# Altium schematic sheet LAN8870_PINOUT.SchDoc
size C; SheetNumber: 19; SheetTotal: 20
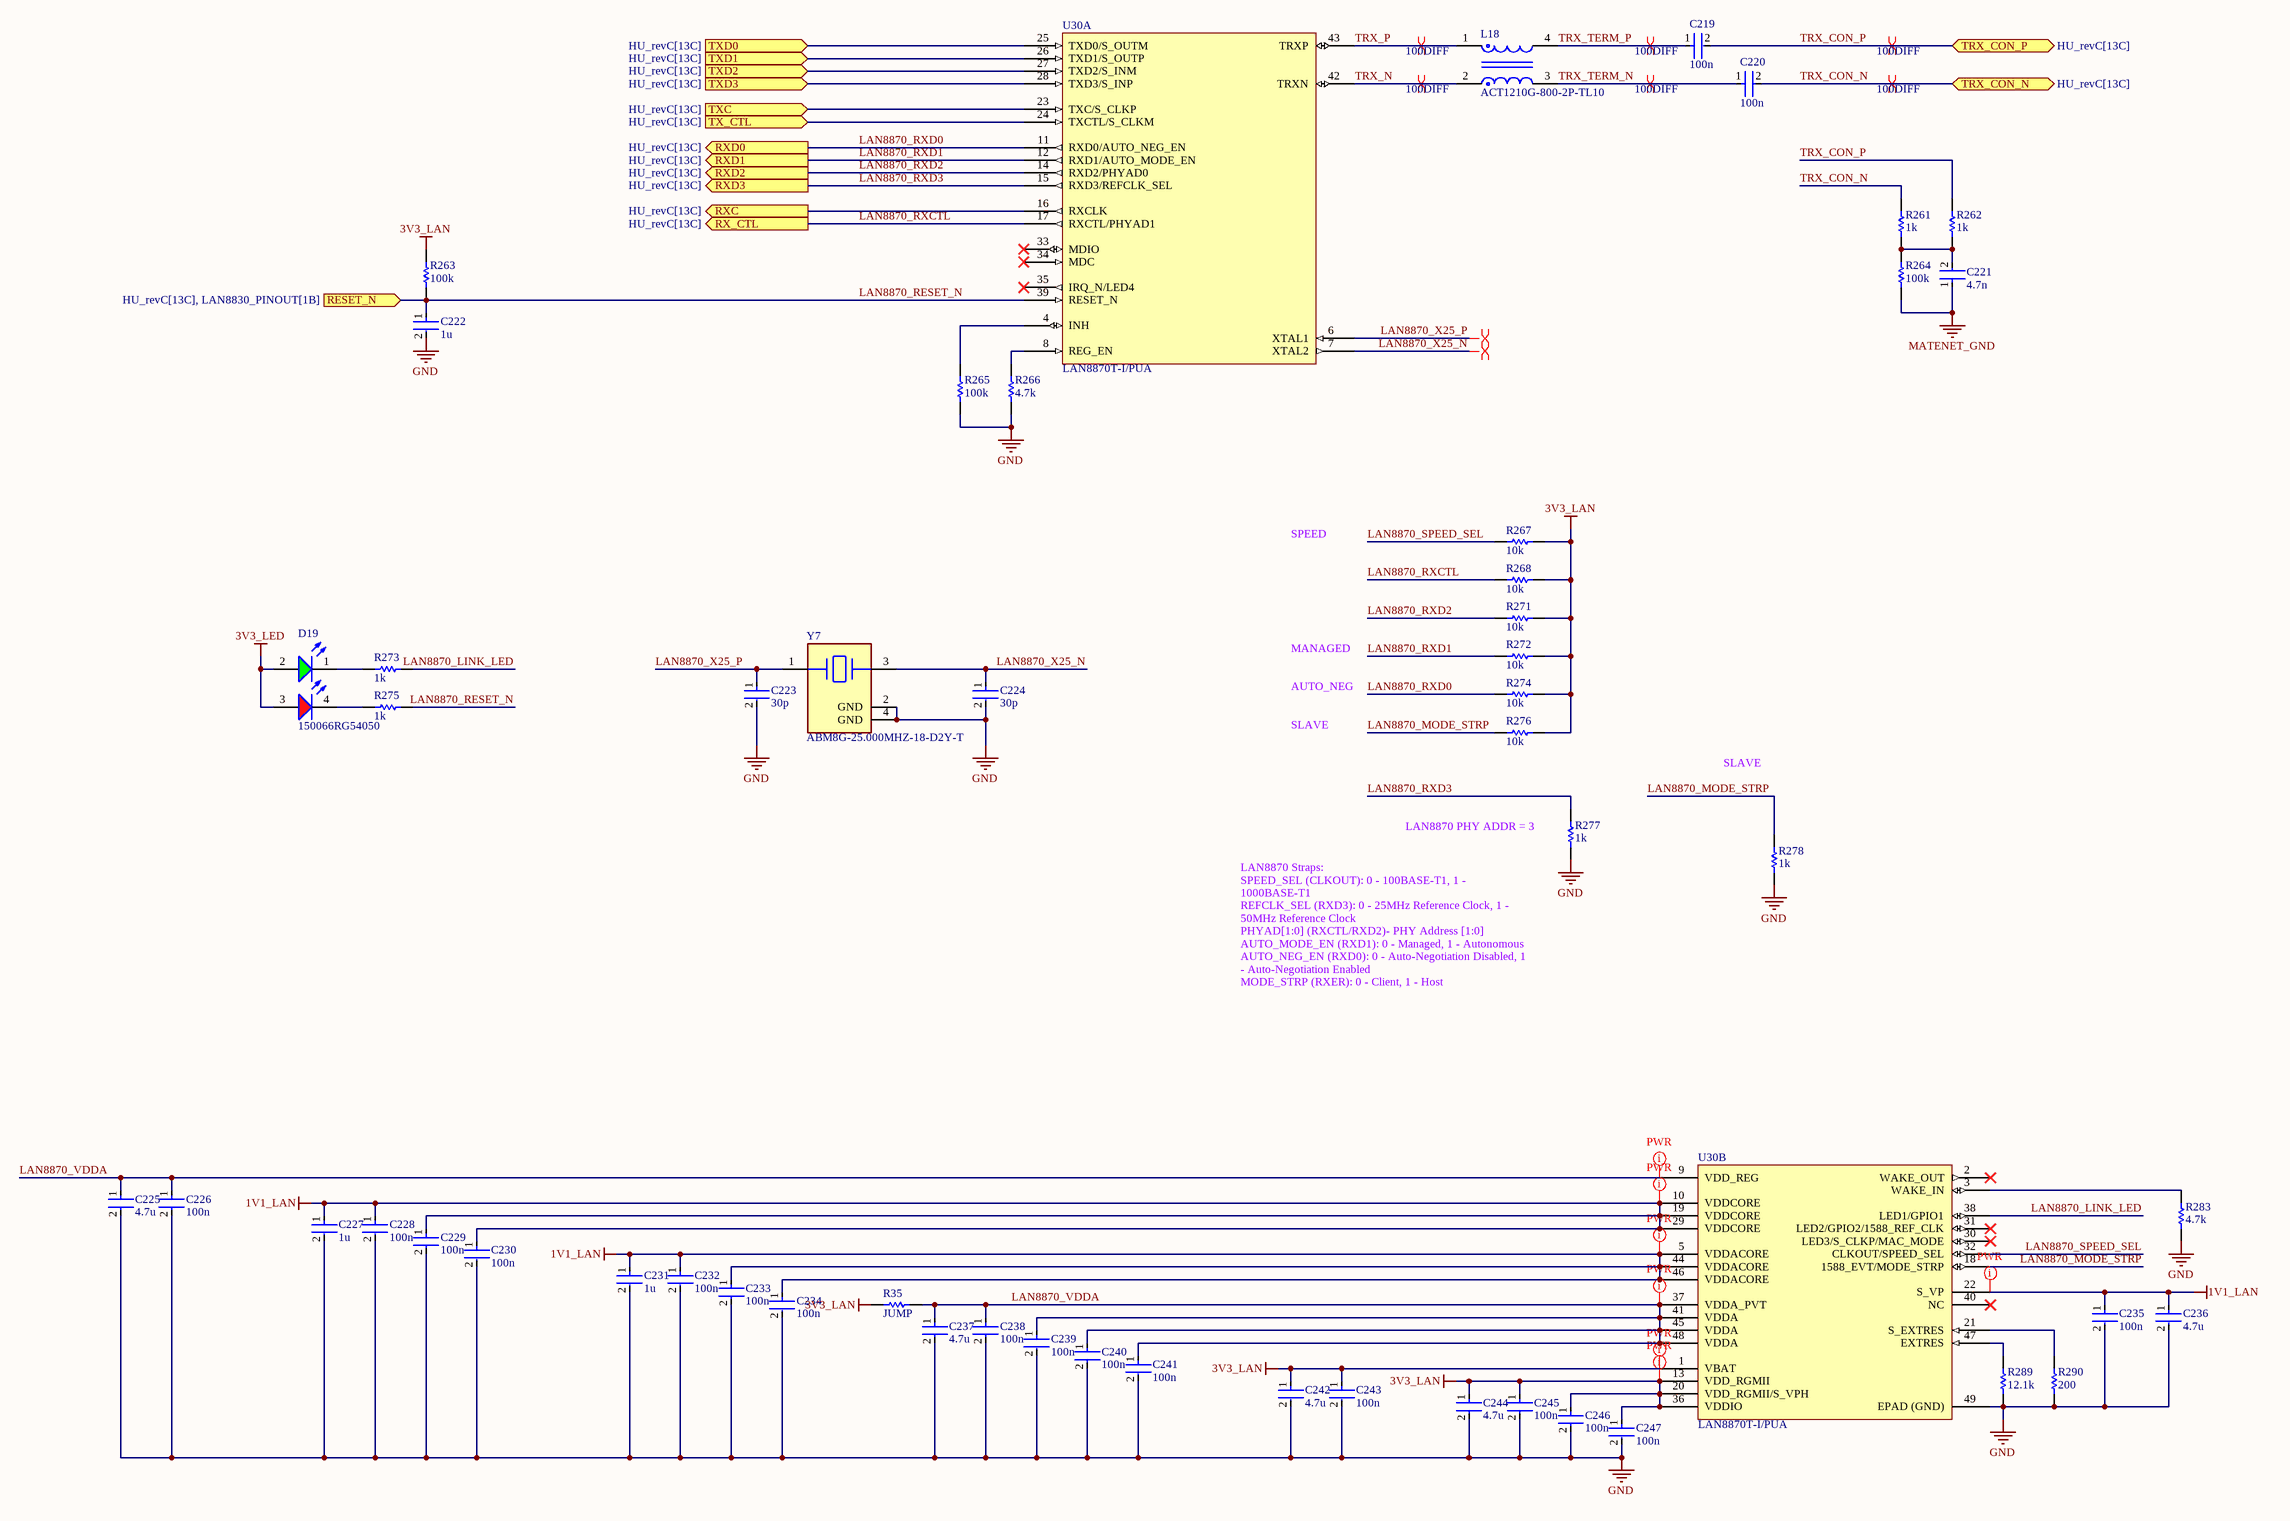
[diagram p0: LAN8870_PINOUT.SchDoc]

## Parts
C219  100n  [FP-0402-L_1_0_0_05-W_0_5-IPC_A]
C220  100n  [FP-0402-L_1_0_0_05-W_0_5-IPC_A]
C221  4.7n  [FP-0402-L_1_0_0_05-W_0_5-IPC_A]
C222  1u  [FP-0402-L_1_0_0_05-W_0_5-IPC_A]
C223  30p  [FP-0402-L_1_0_0_05-W_0_5-IPC_A]
C224  30p  [FP-0402-L_1_0_0_05-W_0_5-IPC_A]
C225  4.7u  [FP-0402-L_1_0_0_05-W_0_5-IPC_A]
C226  100n  [FP-0402-L_1_0_0_05-W_0_5-IPC_A]
C227  1u  [FP-0402-L_1_0_0_05-W_0_5-IPC_A]
C228  100n  [FP-0402-L_1_0_0_05-W_0_5-IPC_A]
C229  100n  [FP-0402-L_1_0_0_05-W_0_5-IPC_A]
C230  100n  [FP-0402-L_1_0_0_05-W_0_5-IPC_A]
C231  1u  [FP-0402-L_1_0_0_05-W_0_5-IPC_A]
C232  100n  [FP-0402-L_1_0_0_05-W_0_5-IPC_A]
C233  100n  [FP-0402-L_1_0_0_05-W_0_5-IPC_A]
C234  100n  [FP-0402-L_1_0_0_05-W_0_5-IPC_A]
C235  100n  [FP-0402-L_1_0_0_05-W_0_5-IPC_A]
C236  4.7u  [FP-0402-L_1_0_0_05-W_0_5-IPC_A]
C237  4.7u  [FP-0402-L_1_0_0_05-W_0_5-IPC_A]
C238  100n  [FP-0402-L_1_0_0_05-W_0_5-IPC_A]
C239  100n  [FP-0402-L_1_0_0_05-W_0_5-IPC_A]
C240  100n  [FP-0402-L_1_0_0_05-W_0_5-IPC_A]
C241  100n  [FP-0402-L_1_0_0_05-W_0_5-IPC_A]
C242  4.7u  [FP-0402-L_1_0_0_05-W_0_5-IPC_A]
C243  100n  [FP-0402-L_1_0_0_05-W_0_5-IPC_A]
C244  4.7u  [FP-0402-L_1_0_0_05-W_0_5-IPC_A]
C245  100n  [FP-0402-L_1_0_0_05-W_0_5-IPC_A]
C246  100n  [FP-0402-L_1_0_0_05-W_0_5-IPC_A]
C247  100n  [FP-0402-L_1_0_0_05-W_0_5-IPC_A]
D19  150066RG54050  [WL-SBCD_0606]
L18  ACT1210G-800-2P-TL10  [FP-ACT1210G-800-2P-TL10-MFG]
R35  JUMP  [R0603B]
R261  1k  [R0603B]
R262  1k  [R0603B]
R263  100k  [R0603B]
R264  100k  [R0603B]
R265  100k  [R0603B]
R266  4.7k  [R0603B]
R267  10k  [R0603B]
R268  10k  [R0603B]
R271  10k  [R0603B]
R272  10k  [R0603B]
R273  1k  [R0603B]
R274  10k  [R0603B]
R275  1k  [R0603B]
R276  10k  [R0603B]
R277  1k  [R0603B]
R278  1k  [R0603B]
R283  4.7k  [R0603B]
R289  12.1k  [R0603B]
R290  200  [R0603B]
U30  LAN8870T-I/PUA  [QFN50P700X700X100_HS-49N]  (parts A,B of 2)
Y7  ABM8G-25.000MHZ-18-D2Y-T  [FP-ABM8G-MFG]

## Ports
RESET_N (in, see HU_revC[13C], LAN8830_PINOUT[1B]), RX_CTL (out, see HU_revC[13C]), RXC (out, see HU_revC[13C]), RXD0 (out, see HU_revC[13C]), RXD1 (out, see HU_revC[13C]), RXD2 (out, see HU_revC[13C]), RXD3 (out, see HU_revC[13C]), TRX_CON_N (bidir, see HU_revC[13C]), TRX_CON_P (bidir, see HU_revC[13C]), TX_CTL (in, see HU_revC[13C]), TXC (in, see HU_revC[13C]), TXD0 (in, see HU_revC[13C]), TXD1 (in, see HU_revC[13C]), TXD2 (in, see HU_revC[13C]), TXD3 (in, see HU_revC[13C])

## Nets
1V1_LAN: C227.1 C228.1 C229.1 C230.1 C231.1 C232.1 C233.1 C234.1 C235.1 C236.1 U30.5(VDDACORE) U30.10(VDDCORE) U30.19(VDDCORE) U30.22(S_VP) U30.29(VDDCORE) U30.44(VDDACORE) U30.46(VDDACORE)
3V3_LAN: C242.1 C243.1 C244.1 C245.1 C246.1 C247.1 R35.1 R263.1 R267.2 R268.1 R271.2 R272.2 R274.2 R276.2 U30.1(VBAT) U30.13(VDD_RGMII) U30.20(VDD_RGMII/S_VPH) U30.36(VDDIO)
3V3_LED: D19.2(A) D19.3(A)
GND: C222.2 C223.2 C224.2 C225.2 C226.2 C227.2 C228.2 C229.2 C230.2 C231.2 C232.2 C233.2 C234.2 C235.2 C236.2 C237.2 C238.2 C239.2 C240.2 C241.2 C242.2 C243.2 C244.2 C245.2 C246.2 C247.2 R265.2 R266.2 R277.1 R278.1 R283.2 R289.2 R290.2 U30.49(EPAD_(GND)) Y7.2(GND) Y7.4(GND)
MATENET_GND: C221.1 R264.2
LAN8870_LINK_LED: R273.2 U30.38(LED1/GPIO1)
LAN8870_MODE_STRP: R276.1 R278.2 U30.18(1588_EVT/MODE_STRP)
LAN8870_RESET_N: C222.1 R263.2 R275.2 U30.39(RESET_N) ; port RESET_N
LAN8870_RXCTL: R268.2 U30.17(RXCTL/PHYAD1) ; port RX_CTL
LAN8870_RXD0: R274.1 U30.11(RXD0/AUTO_NEG_EN) ; port RXD0
LAN8870_RXD1: R272.1 U30.12(RXD1/AUTO_MODE_EN) ; port RXD1
LAN8870_RXD2: R271.1 U30.14(RXD2/PHYAD0) ; port RXD2
LAN8870_RXD3: R277.2 U30.15(RXD3/REFCLK_SEL) ; port RXD3
LAN8870_SPEED_SEL: R267.1 U30.32(CLKOUT/SPEED_SEL)
LAN8870_VDDA: C225.1 C226.1 C237.1 C238.1 C239.1 C240.1 C241.1 R35.2 U30.9(VDD_REG) U30.37(VDDA_PVT) U30.41(VDDA) U30.45(VDDA) U30.48(VDDA)
LAN8870_X25_N: C224.1 U30.7(XTAL2) Y7.3
LAN8870_X25_P: C223.1 U30.6(XTAL1) Y7.1
RXC: U30.16(RXCLK) ; port RXC
TRX_CON_N: C220.2 R261.2 ; port TRX_CON_N
TRX_CON_P: C219.2 R262.2 ; port TRX_CON_P
TRX_N: L18.2 U30.42(TRXN)
TRX_P: L18.1 U30.43(TRXP)
TRX_TERM_N: C220.1 L18.3
TRX_TERM_P: C219.1 L18.4
TX_CTL: U30.24(TXCTL/S_CLKM) ; port TX_CTL
TXC: U30.23(TXC/S_CLKP) ; port TXC
TXD0: U30.25(TXD0/S_OUTM) ; port TXD0
TXD1: U30.26(TXD1/S_OUTP) ; port TXD1
TXD2: U30.27(TXD2/S_INM) ; port TXD2
TXD3: U30.28(TXD3/S_INP) ; port TXD3
NetC221_2: C221.2 R261.1 R262.1 R264.1
NetD19_1: D19.1(K) R273.1
NetD19_4: D19.4(K) R275.1
NetR265_1: R265.1 U30.4(INH)
NetR266_1: R266.1 U30.8(REG_EN)
NetR283_1: R283.1 U30.3(WAKE_IN)
NetR289_1: R289.1 U30.47(EXTRES)
NetR290_1: R290.1 U30.21(S_EXTRES)

Not connected (* = marked no-connect by the designer): U30 2(WAKE_OUT)* 30(LED3/S_CLKP/MAC_MODE)* 31(LED2/GPIO2/1588_REF_CLK)* 33(MDIO)* 34(MDC)* 35(IRQ_N/LED4)* 40(NC)*

## Layout directives
differential pair; differential pair class 100DIFF: TRX_CON_N, TRX_CON_P, TRX_N, TRX_P, TRX_TERM_N, TRX_TERM_P
differential pair: LAN8870_X25_N, LAN8870_X25_P
net class PWR: 1V1_LAN, 3V3_LAN, LAN8870_VDDA

## Notes on the sheet
- SPEED
- AUTO_NEG
- MANAGED
- SLAVE
- LAN8870 PHY ADDR = 3
- (near R277) LAN8870 Straps:
  SPEED_SEL (CLKOUT): 0 - 100BASE-T1, 1 - 1000BASE-T1
  REFCLK_SEL (RXD3): 0 - 25MHz Reference Clock, 1 - 50MHz Reference Clock
  PHYAD[1:0] (RXCTL/RXD2)- PHY Address [1:0]
  AUTO_MODE_EN (RXD1): 0 - Managed, 1 - Autonomous
  AUTO_NEG_EN (RXD0): 0 - Auto-Negotiation Disabled, 1 - Auto-Negotiation Enabled
  MODE_STRP (RXER): 0 - Client, 1 - Host

## Library data of the parts
C219-C247 = CMP-001-00058-1: LARGE PADS, 0402 CAP, CHANGE COMMENT TO MATCH REAL P/N; Capacitor Type: Ceramic; Min Operating Temperature: -55°C; Mounting Technology: Surface Mount; Pins: 2; Case/Package: 0402; RoHS Compliant: Yes; Max Operating Temperature: 85°C
D19 = CMP-004-00040-2: Led, Red/Grn, 180Mcd/230Mcd, 624Nm/525Nm Rohs Compliant: Yes; Source: rgled.SchLib; Component Type: Standard; Design Item ID: CMP-004-00034-2; Pins: 4
L18 = CMP-08256-000023-1: CMC 80UH 70MA 2LN 3.8KOHM SMD
R35 = CMP-009-00002-14: Resistor; Value: 0
R261 R262 R266-R268 R271-R278 R283 R289 R290 = CMP-009-00002-14: Resistor; Value: 100k
R263-R265 = CMP-009-00002-14: Resistor; Value: 100k
U30 = CMP-015-00023-5: 100/1000BASE-T1 Rgmii/sgmii Phy; Case/Package: VQFN; Pins: 48
Y7 = CMP-2000-05733-3: Crystal 25MHz ±20ppm (Tol) ±30ppm (Stability) 18pF FUND 60Ω 4-Pin SMD T/R; Series Resistance: 60R; Length: 3.2mm; Depth: 2.5mm; Packaging: Tape and Reel; Min Operating Temperature: -40°C; Operating Frequency: 25 MHz; Lead Free: Lead Free; Number of Pins: 4; Frequency Tolerance: 20ppm; Radiation Hardening: No; Max Operating Temperature: 85°C; Termination: SMD/SMT; Frequency Stability: 30ppm; Frequency: 25MHz; Series: ABM8G; Mount: Surface Mount; Package Quantity: 1000; Height: 0.039inch; Width: 0.098inch; Case/Package: CSMD; ESR (Equivalent Series Resistance): 60R; Load Capacitance: 18pF; Tolerance: 20ppm